# Altium schematic sheet BatteryBalancingRev3.SchDoc: Passive Cell Balancing Circuit
size 279 x 215 mm; Engineer: Josh Harper; Revision: 3; SheetNumber: 3; SheetTotal: 6
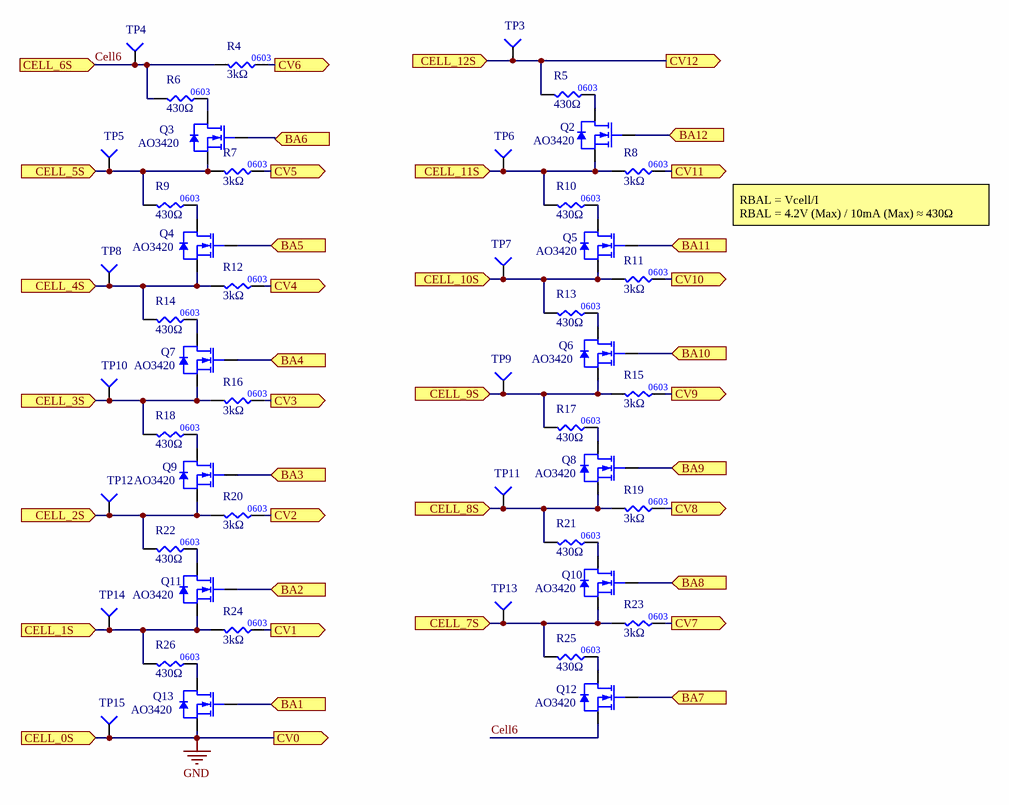
[diagram p0: BatteryBalancingRev3.SchDoc]

## Parts
Q2  Manufacturer Part Number 1: AO3420  [SOT23-3]  (hidden comment: NMOS_20V_6A)
Q3  Manufacturer Part Number 1: AO3420  [SOT23-3]  (hidden comment: NMOS_20V_6A)
Q4  Manufacturer Part Number 1: AO3420  [SOT23-3]  (hidden comment: NMOS_20V_6A)
Q5  Manufacturer Part Number 1: AO3420  [SOT23-3]  (hidden comment: NMOS_20V_6A)
Q6  Manufacturer Part Number 1: AO3420  [SOT23-3]  (hidden comment: NMOS_20V_6A)
Q7  Manufacturer Part Number 1: AO3420  [SOT23-3]  (hidden comment: NMOS_20V_6A)
Q8  Manufacturer Part Number 1: AO3420  [SOT23-3]  (hidden comment: NMOS_20V_6A)
Q9  Manufacturer Part Number 1: AO3420  [SOT23-3]  (hidden comment: NMOS_20V_6A)
Q10  Manufacturer Part Number 1: AO3420  [SOT23-3]  (hidden comment: NMOS_20V_6A)
Q11  Manufacturer Part Number 1: AO3420  [SOT23-3]  (hidden comment: NMOS_20V_6A)
Q12  Manufacturer Part Number 1: AO3420  [SOT23-3]  (hidden comment: NMOS_20V_6A)
Q13  Manufacturer Part Number 1: AO3420  [SOT23-3]  (hidden comment: NMOS_20V_6A)
R4  value 3kΩ  [RES0603]  (hidden comment: RES_3kΩ_0603_1%)
R5  value 430Ω  [RES0603]  (hidden comment: RES_430Ω_0603_5%)
R6  value 430Ω  [RES0603]  (hidden comment: RES_430Ω_0603_5%)
R7  value 3kΩ  [RES0603]  (hidden comment: RES_3kΩ_0603_1%)
R8  value 3kΩ  [RES0603]  (hidden comment: RES_3kΩ_0603_1%)
R9  value 430Ω  [RES0603]  (hidden comment: RES_430Ω_0603_5%)
R10  value 430Ω  [RES0603]  (hidden comment: RES_430Ω_0603_5%)
R11  value 3kΩ  [RES0603]  (hidden comment: RES_3kΩ_0603_1%)
R12  value 3kΩ  [RES0603]  (hidden comment: RES_3kΩ_0603_1%)
R13  value 430Ω  [RES0603]  (hidden comment: RES_430Ω_0603_5%)
R14  value 430Ω  [RES0603]  (hidden comment: RES_430Ω_0603_5%)
R15  value 3kΩ  [RES0603]  (hidden comment: RES_3kΩ_0603_1%)
R16  value 3kΩ  [RES0603]  (hidden comment: RES_3kΩ_0603_1%)
R17  value 430Ω  [RES0603]  (hidden comment: RES_430Ω_0603_5%)
R18  value 430Ω  [RES0603]  (hidden comment: RES_430Ω_0603_5%)
R19  value 3kΩ  [RES0603]  (hidden comment: RES_3kΩ_0603_1%)
R20  value 3kΩ  [RES0603]  (hidden comment: RES_3kΩ_0603_1%)
R21  value 430Ω  [RES0603]  (hidden comment: RES_430Ω_0603_5%)
R22  value 430Ω  [RES0603]  (hidden comment: RES_430Ω_0603_5%)
R23  value 3kΩ  [RES0603]  (hidden comment: RES_3kΩ_0603_1%)
R24  value 3kΩ  [RES0603]  (hidden comment: RES_3kΩ_0603_1%)
R25  value 430Ω  [RES0603]  (hidden comment: RES_430Ω_0603_5%)
R26  value 430Ω  [RES0603]  (hidden comment: RES_430Ω_0603_5%)
TP3  TESTPOINT_1MM_SQUARE  [TESTPOINT_SQUARE_1MM]  (value not drawn)  (no BOM)
TP4  TESTPOINT_1MM_SQUARE  [TESTPOINT_SQUARE_1MM]  (value not drawn)  (no BOM)
TP5  TESTPOINT_1MM_SQUARE  [TESTPOINT_SQUARE_1MM]  (value not drawn)  (no BOM)
TP6  TESTPOINT_1MM_SQUARE  [TESTPOINT_SQUARE_1MM]  (value not drawn)  (no BOM)
TP7  TESTPOINT_1MM_SQUARE  [TESTPOINT_SQUARE_1MM]  (value not drawn)  (no BOM)
TP8  TESTPOINT_1MM_SQUARE  [TESTPOINT_SQUARE_1MM]  (value not drawn)  (no BOM)
TP9  TESTPOINT_1MM_SQUARE  [TESTPOINT_SQUARE_1MM]  (value not drawn)  (no BOM)
TP10  TESTPOINT_1MM_SQUARE  [TESTPOINT_SQUARE_1MM]  (value not drawn)  (no BOM)
TP11  TESTPOINT_1MM_SQUARE  [TESTPOINT_SQUARE_1MM]  (value not drawn)  (no BOM)
TP12  TESTPOINT_1MM_SQUARE  [TESTPOINT_SQUARE_1MM]  (value not drawn)  (no BOM)
TP13  TESTPOINT_1MM_SQUARE  [TESTPOINT_SQUARE_1MM]  (value not drawn)  (no BOM)
TP14  TESTPOINT_1MM_SQUARE  [TESTPOINT_SQUARE_1MM]  (value not drawn)  (no BOM)
TP15  TESTPOINT_1MM_SQUARE  [TESTPOINT_SQUARE_1MM]  (value not drawn)  (no BOM)

## Ports
BA1 (in), BA2 (in), BA3 (in), BA4 (in), BA5 (in), BA6 (in), BA7 (in), BA8 (in), BA9 (in), BA10 (in), BA11 (in), BA12 (in), CELL_0S (in), CELL_1S (in), CELL_2S (in), CELL_3S (in), CELL_4S (in), CELL_5S (in), CELL_6S (in), CELL_7S (in), CELL_8S (in), CELL_9S (in), CELL_10S (in), CELL_11S (in), CELL_12S (in), CV0 (out), CV1 (out), CV2 (out), CV3 (out), CV4 (out), CV5 (out), CV6 (out), CV7 (out), CV8 (out), CV9 (out), CV10 (out), CV11 (out), CV12 (out)

## Nets
GND: Q13.2(SOURCE) TP15.1(=value) ; port CELL_0S, port CV0
BA1: Q13.1(GATE) ; port BA1
BA2: Q11.1(GATE) ; port BA2
BA3: Q9.1(GATE) ; port BA3
BA4: Q7.1(GATE) ; port BA4
BA5: Q4.1(GATE) ; port BA5
BA6: Q3.1(GATE) ; port BA6
BA7: Q12.1(GATE) ; port BA7
BA8: Q10.1(GATE) ; port BA8
BA9: Q8.1(GATE) ; port BA9
BA10: Q6.1(GATE) ; port BA10
BA11: Q5.1(GATE) ; port BA11
BA12: Q2.1(GATE) ; port BA12
Cell6: Q12.2(SOURCE) R4.1 R6.1 TP4.1(=value) ; port CELL_6S
CELL_1S: Q11.2(SOURCE) R24.1 R26.1 TP14.1(=value) ; port CELL_1S
CELL_2S: Q9.2(SOURCE) R20.1 R22.1 TP12.1(=value) ; port CELL_2S
CELL_3S: Q7.2(SOURCE) R16.1 R18.1 TP10.1(=value) ; port CELL_3S
CELL_4S: Q4.2(SOURCE) R12.1 R14.1 TP8.1(=value) ; port CELL_4S
CELL_5S: Q3.2(SOURCE) R7.1 R9.1 TP5.1(=value) ; port CELL_5S
CELL_7S: Q10.2(SOURCE) R23.1 R25.1 TP13.1(=value) ; port CELL_7S
CELL_8S: Q8.2(SOURCE) R19.1 R21.1 TP11.1(=value) ; port CELL_8S
CELL_9S: Q6.2(SOURCE) R15.1 R17.1 TP9.1(=value) ; port CELL_9S
CELL_10S: Q5.2(SOURCE) R11.1 R13.1 TP7.1(=value) ; port CELL_10S
CELL_11S: Q2.2(SOURCE) R8.1 R10.1 TP6.1(=value) ; port CELL_11S
CELL_12S: R5.1 TP3.1(=value) ; port CELL_12S, port CV12
CV1: R24.2 ; port CV1
CV2: R20.2 ; port CV2
CV3: R16.2 ; port CV3
CV4: R12.2 ; port CV4
CV5: R7.2 ; port CV5
CV6: R4.2 ; port CV6
CV7: R23.2 ; port CV7
CV8: R19.2 ; port CV8
CV9: R15.2 ; port CV9
CV10: R11.2 ; port CV10
CV11: R8.2 ; port CV11
NetQ2_3: Q2.3(DRAIN) R5.2
NetQ3_3: Q3.3(DRAIN) R6.2
NetQ4_3: Q4.3(DRAIN) R9.2
NetQ5_3: Q5.3(DRAIN) R10.2
NetQ6_3: Q6.3(DRAIN) R13.2
NetQ7_3: Q7.3(DRAIN) R14.2
NetQ8_3: Q8.3(DRAIN) R17.2
NetQ9_3: Q9.3(DRAIN) R18.2
NetQ10_3: Q10.3(DRAIN) R21.2
NetQ11_3: Q11.3(DRAIN) R22.2
NetQ12_3: Q12.3(DRAIN) R25.2
NetQ13_3: Q13.3(DRAIN) R26.2

## Notes on the sheet
- RBAL = Vcell/I
  RBAL = 4.2V (Max) / 10mA (Max) ≈ 430Ω
- University of Waterloo Robotics Team
- 200 University Ave W
- REV
- PROJECT
- Waterloo, Ontario, Canada
- N2L 3G1
- DOCUMENT
- ENGINEER
- REVIEWER
- MODIFIED
- SHEET
- OF
- (in symbol RES_3kΩ_0603_1%) 0603

## Library data of the parts
Q2-Q13 = NMOS_20V_6A: MOSFET N-CH 20V 6A SOT-23; Manufacturer 1: Alpha & Omega; Supplier 1: Digi-Key; Supplier Part Number 1: 785-1014-2-ND
R4 R7 R8 R11 R12 R15 R16 R19 R20 R23 R24 = RES_3kΩ_0603_1%: RES 3K OHM 1% 1/10W 0603; Manufacturer 1: Yageo; Manufacturer Part Number 1: RC0603FR-073KL; Supplier 1: Digi-Key; Supplier Part Number 1: 311-3.00KHRCT-ND
R5 R6 R9 R10 R13 R14 R17 R18 R21 R22 R25 R26 = RES_430Ω_0603_5%: RES 430 OHM 5% 1/10W 0603; Manufacturer 1: Stackpole Electronics; Manufacturer Part Number 1: RMCF0603JT430R; Package/Footprint: 0603; Supplier Part Number 1: RMCF0603JT430R; Supplier 1: Digi-Key; Mounting Type: SMD
TP3 = TESTPOINT_1MM_SQUARE: CELL6
TP4 TP6 = TESTPOINT_1MM_SQUARE: CELL11
TP5 = TESTPOINT_1MM_SQUARE: CELL5
TP7 = TESTPOINT_1MM_SQUARE: CELL10
TP8 = TESTPOINT_1MM_SQUARE: CELL4
TP9 = TESTPOINT_1MM_SQUARE: CELL9
TP10 = TESTPOINT_1MM_SQUARE: CELL3
TP11 = TESTPOINT_1MM_SQUARE: CELL8
TP12 = TESTPOINT_1MM_SQUARE: CELL2
TP13 = TESTPOINT_1MM_SQUARE: CELL7
TP14 = TESTPOINT_1MM_SQUARE: CELL1
TP15 = TESTPOINT_1MM_SQUARE: CELL0